# EAGLE design SNES_RGB_SV (EAGLE 9.6.2)
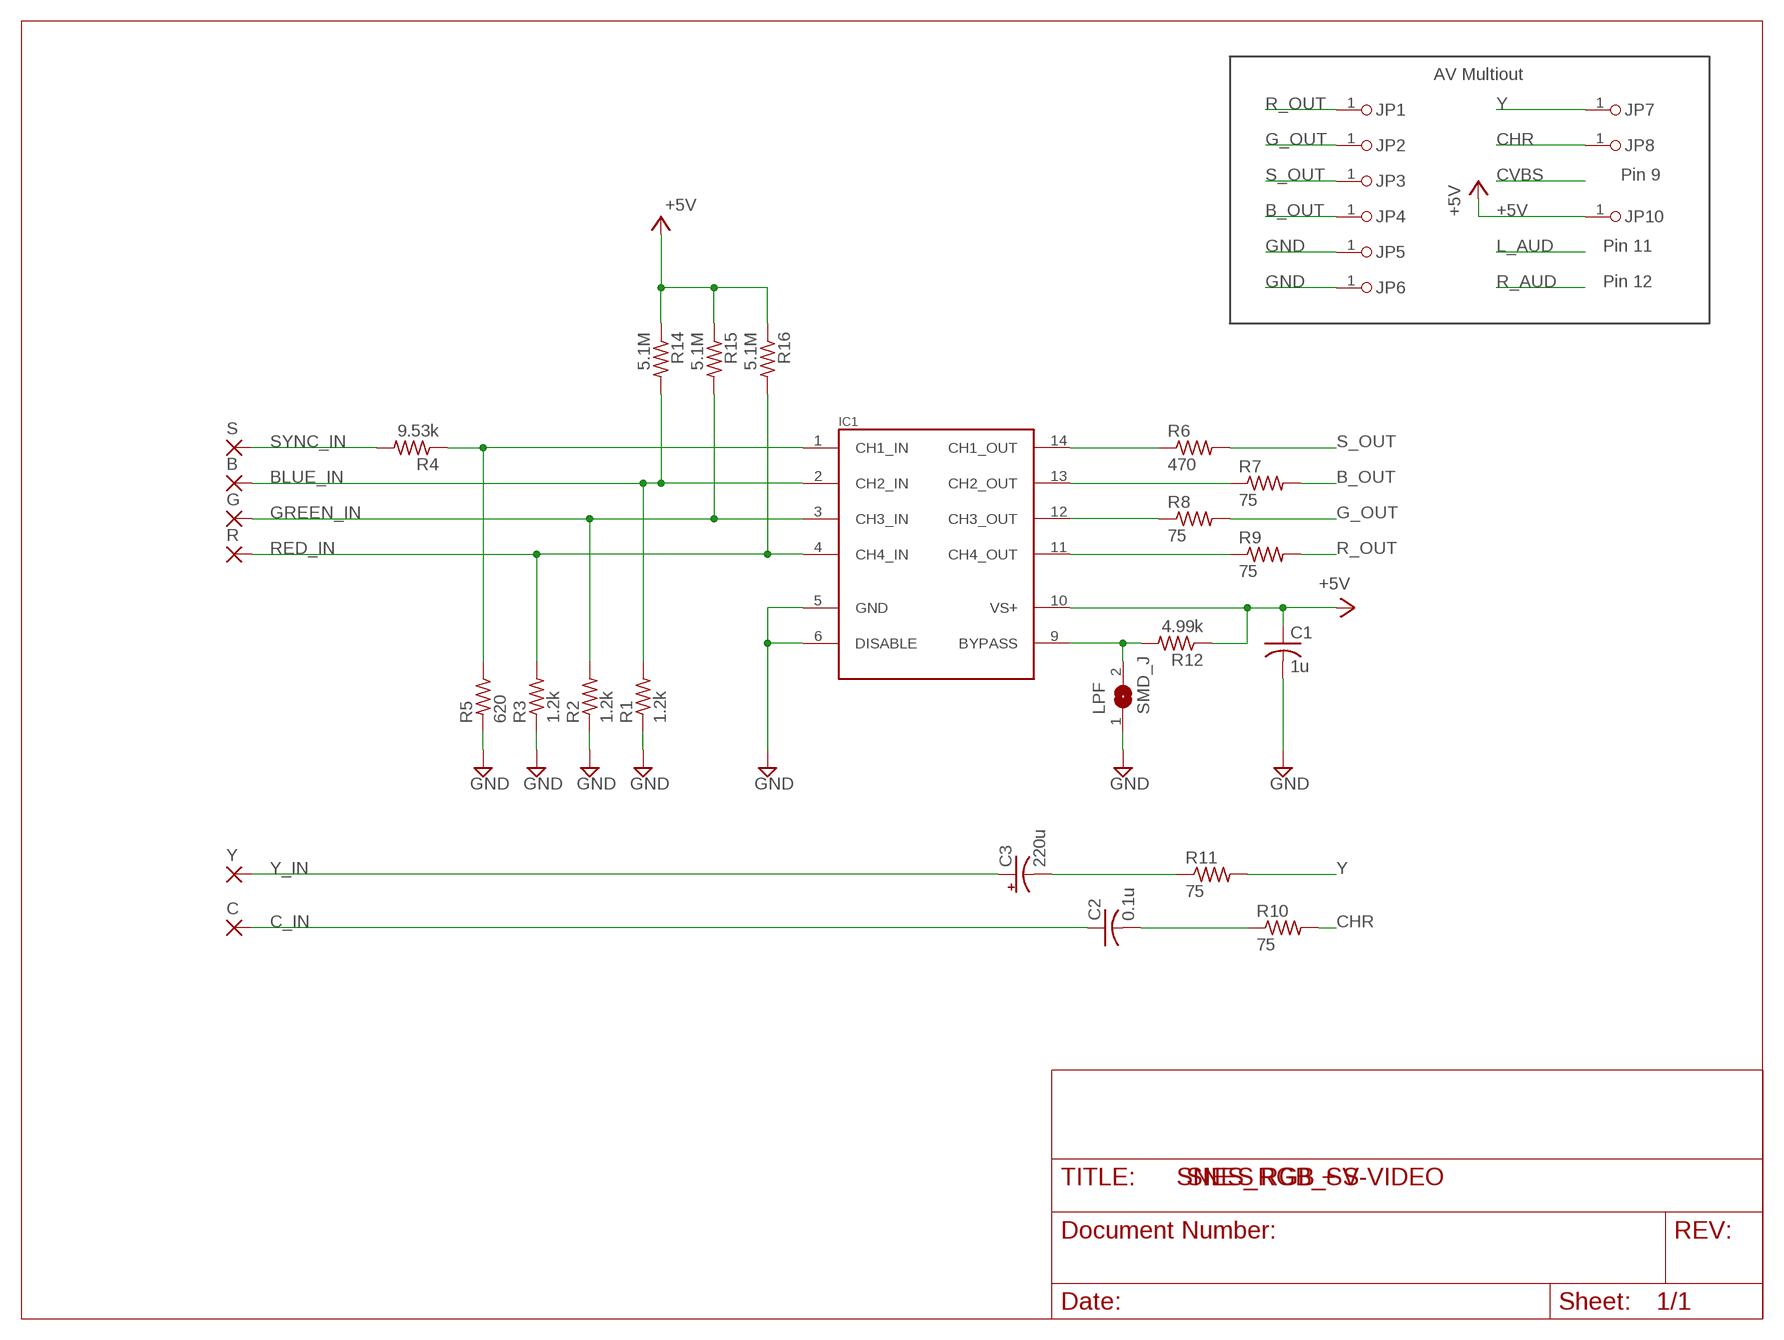
[diagram p0: schematic, sheet 1]

## Parts
B  SMD2  [SMD1,27-2,54]
C  SMD2  [SMD1,27-2,54]
C1  1u  C-USC0603  [C0603]
C2  0.1u  C-USC0603  [C0603]
C3  220u  CPOL-USC/6032-28R  [C/6032-28R]
G  SMD2  [SMD1,27-2,54]
IC1  THS7374IPWR  [TSSOP14]
JP1  PINHD-1X1  [1X01]
JP2  PINHD-1X1  [1X01]
JP3  PINHD-1X1  [1X01]
JP4  PINHD-1X1  [1X01]
JP5  PINHD-1X1  [1X01]
JP6  PINHD-1X1  [1X01]
JP7  PINHD-1X1  [1X01]
JP8  PINHD-1X1  [1X01]
JP10  PINHD-1X1  [1X01]
LPF  SMD_J  [SJ]
R  SMD2  [SMD1,27-2,54]
R1  1.2k  R-US_R0603  [R0603]
R2  1.2k  R-US_R0603  [R0603]
R3  1.2k  R-US_R0603  [R0603]
R4  9.53k  R-US_R0603  [R0603]
R5  620  R-US_R0603  [R0603]
R6  470  R-US_R0603  [R0603]
R7  75  R-US_R0603  [R0603]
R8  75  R-US_R0603  [R0603]
R9  75  R-US_R0603  [R0603]
R10  75  R-US_R0603  [R0603]
R11  75  R-US_R0603  [R0603]
R12  4.99k  R-US_R0603  [R0603]
R14  5.1M  R-US_R0603  [R0603]
R15  5.1M  R-US_R0603  [R0603]
R16  5.1M  R-US_R0603  [R0603]
S  SMD2  [SMD1,27-2,54]
Y  SMD2  [SMD1,27-2,54]

## Nets
+5V: C1.1 IC1.10(VS+) JP10.1 R12.1 R14.1 R15.1 R16.1
B_OUT: JP4.1 R7.2
BLUE_IN: B.1(P) IC1.2(CH2_IN) R1.2 R14.2
C_IN: C2.1 C.1(P)
CHR: JP8.1 R10.2
G_OUT: JP2.1 R8.2
GND: C1.2 IC1.5(GND) IC1.6(DISABLE) JP5.1 JP6.1 LPF.1 R1.1 R2.1 R3.1 R5.2
GREEN_IN: G.1(P) IC1.3(CH3_IN) R2.2 R15.2
N$1: IC1.1(CH1_IN) R4.1 R5.1
N$2: IC1.9(BYPASS) LPF.2 R12.2
N$3: IC1.14(CH1_OUT) R6.1
N$4: IC1.13(CH2_OUT) R7.1
N$5: IC1.12(CH3_OUT) R8.1
N$6: IC1.11(CH4_OUT) R9.1
N$7: C2.2 R10.1
N$10: C3.- R11.1
R_OUT: JP1.1 R9.2
RED_IN: IC1.4(CH4_IN) R3.2 R16.2 R.1(P)
S_OUT: JP3.1 R6.2
SYNC_IN: R4.2 S.1(P)
Y: JP7.1 R11.2
Y_IN: C3.+ Y.1(P)

## Notes on the sheet
- AV Multiout
- Pin 9
- Pin 11
- Pin 12
- SNES RGB + S-VIDEO

## Library data of the parts
B C G R S Y = wirepad:SMD2: SMD PAD
C1 C2 = My_Devices:C-US: CAPACITOR, American symbol
C3 = My_Devices:CPOL-US: POLARIZED CAPACITOR, American symbol; SPICEPREFIX: C
IC1 = My_Devices:THS7374
JP1-JP8 JP10 = My_Devices:PINHD-1X1: PIN HEADER
LPF = My_Devices:SMD_J
R1-R12 R14-R16 = My_Devices:R-US_: RESISTOR, American symbol

## Board
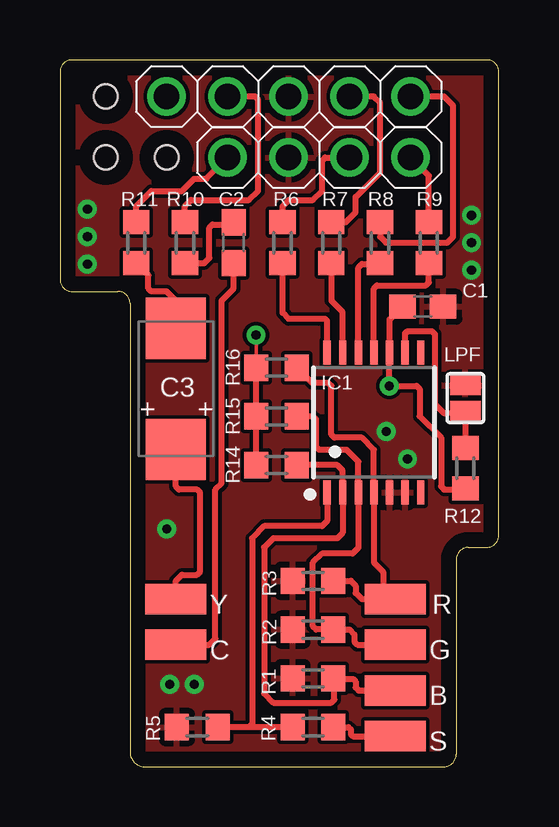
[diagram p1: board, top side]
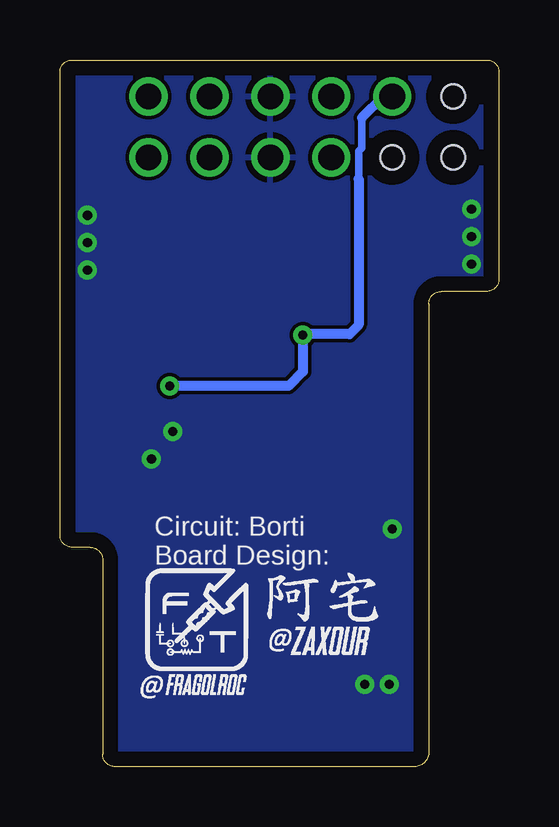
[diagram p2: board, bottom side, seen from below]

Size 18.29 x 29.48 mm. Coordinates in mm from the lower left corner, seen from the top.
Outline: 3.68,0.01 16,0.01 arc90 16.51,0.52 16.51,8.65 arc-90 17.02,9.16 17.78,9.16 arc90 18.29,9.66 18.29,28.97 arc90 17.78,29.48 0.51,29.48 arc90 0,28.97 0,20.33 arc90 0.51,19.82 2.41,19.82 arc-90 2.92,19.32 2.92,0.52 arc90 3.68,0.01
Copper layers (1*16): Top 0.035mm / dielectric 1.5mm / Bottom 0.035mm
Design rules "default *": minimum track width 6mil, minimum drill 0.35mm, track to track 6mil, track to pad 6mil, pad to pad 6mil, via to via 6mil, smd to smd 6mil, copper to edge 25mil, drill to drill 6mil, minimum pad ring 10mil, minimum via ring 8mil, stop-mask expansion 4mil, vias tented up to drill 16mil, thermal gap 10mil
Holes 0.99 mm at 1.91,27.95 1.91,25.41 4.45,25.41

### Footprints (pad centres in the part's own frame; a part is rotated, then mirrored left to right if it is on the bottom)
SMD1,27-2,54 = smd 1.27 x 2.54: 1 0,0
C0603 = smd 1.1 x 1: 1 -0.85,0; 2 0.85,0
C/6032-28R = smd 2.55 x 2.5: + 2.525,0; - -2.525,0
TSSOP14 = smd 0.305 x 0.991: 1 -1.95,-2.918; 2 -1.3,-2.918; 3 -0.65,-2.918; 4 0,-2.918; 5 0.65,-2.918; 6 1.3,-2.918; 7 1.95,-2.918; 8 1.95,2.918; 9 1.3,2.918; 10 0.65,2.918; 11 0,2.918; 12 -0.65,2.918; 13 -1.3,2.918; 14 -1.95,2.918
1X01 = drill 1.067 pad 1.575: 1 0,0
SJ = smd 0.813 x 1.27: 1 -0.533,0; 2 0.533,0
R0603 = smd 1 x 1.1: 1 -0.85,0; 2 0.85,0

### Placement (x,y rotation side)
B  13.97,3.19 270 top
C  4.83,5.09 270 top
C1  15.11,19.19 0 top
C2  7.24,21.86 90 top
C3  4.83,15.76 270 top
G  13.97,5.09 270 top
IC1  13.08,14.36 0 top
JP1  14.61,25.41 0 top
JP2  14.61,27.95 0 top
JP3  12.07,25.41 0 top
JP4  12.07,27.95 0 top
JP5  9.53,25.41 0 top
JP6  9.53,27.95 0 top
JP7  6.99,25.41 0 top
JP8  6.99,27.95 0 top
JP10  4.45,27.95 0 top
LPF  16.89,15.38 270 top
R  13.97,7 270 top
R1  10.54,3.7 0 top
R2  10.54,5.73 0 top
R3  10.54,7.76 0 top
R4  10.54,1.66 0 top
R5  5.71,1.66 180 top
R6  9.27,21.86 90 top
R7  11.3,21.86 90 top
R8  13.34,21.86 90 top
R9  15.37,21.86 90 top
R10  5.21,21.86 90 top
R11  3.18,21.86 90 top
R12  16.89,12.46 90 top
R14  9.02,12.59 0 top
R15  9.02,14.62 0 top
R16  9.02,16.65 0 top
S  13.97,1.28 270 top
Y  4.83,7 270 top

### Tracks (layer width: path | path; a pad name or v marks a point on that pad's centre or on a via)
+5V  (via drill 0.38)
  Top 0.152: v8.17,18.01 R16.1
  Top 0.254: C1.1 13.73,18.66 IC1.10 13.72,17.27 v13.72,15.89 14.86,15.89 14.99,15.76 14.99,14.62 15.88,13.73 15.88,11.7 16,11.57 16.85,11.57 R12.1 | R14.1 R15.1 R16.1
  Bottom 0.305: 5.84,24.52 5.84,25.67 5.71,25.79 5.71,27.06
  Bottom 0.406: JP10.1 4.83,27.95 5.71,27.06 | v13.72,15.89 8.76,15.89 8.17,16.48 v8.17,18.01 8.13,18.05 6.22,18.05 5.84,18.43 5.84,24.52
B_OUT
  Top 0.254: R7.2 11.9,22.71 12.32,23.13 12.32,23.76 13.34,24.78 13.34,27.7 13.08,27.95 JP4.1
BLUE_IN
  Top 0.254: R14.2 11.56,12.59 11.78,12.36 IC1.2 11.78,9.76 11.56,9.54 8.89,9.54 8.51,9.16 8.51,3.06 8.89,2.68 11.3,2.68 11.43,2.81 11.43,3.66 R1.2 11.42,3.67 12.22,3.67 12.32,3.57 12.32,3.31 12.45,3.19 B.1
C_IN
  Top 0.254: C.1 6.22,5.09 6.48,5.35 6.48,11.57 6.73,11.82 6.73,19.44 7.24,19.95 C2.1
CHR
  Top 0.254: R10.2 5.21,23.38 5.46,23.63 7.87,23.63 8.26,24.02 8.26,27.83 8.13,27.95 JP8.1
G_OUT
  Top 0.254: R8.2 13.34,22.11 13.59,21.86 16.13,21.86 16.38,22.11 16.38,27.57 16,27.95 JP2.1
GND  (via drill 0.38)
  other vias: 17.14,20.71 1.14,20.97 1.14,22.11 1.14,23.25 17.14,21.86 17.14,23 14.48,12.84 13.59,13.98 4.45,9.92 4.57,3.44 5.59,3.44
  pour Bottom: -0.63,30.49 -0.63,-3.8 23.5,-3.8 23.5,30.49
  pour Top: -1.27,-3.8 24.13,-3.8 24.13,30.49 -1.27,30.49
GREEN_IN
  Top 0.254: R15.2 10.54,14.62 10.67,14.49 10.67,13.35 10.79,13.22 11.94,13.22 12.43,12.73 IC1.3 12.43,9.14 12.19,8.9 10.92,8.9 10.54,8.52 10.54,5.85 10.67,5.73 R2.2 12.07,5.73 12.27,5.52 12.27,5.22 12.39,5.09 G.1
N$1
  Top 0.254: R4.1 7.87,1.66 | 7.87,1.66 R5.1 | IC1.1 11.13,10.25 10.92,10.05 8.51,10.05 8,9.54 8,1.79 7.87,1.66
N$2
  Top 0.254: IC1.9 14.38,18.08 14.48,18.17 15.49,18.17 15.62,18.05 15.62,15.13 16,14.74 LPF.2 R12.2
N$3
  Top 0.254: IC1.14 11.13,18.6 11.05,18.68 9.53,18.68 9.27,18.94 R6.1
N$4
  Top 0.254: R7.1 11.3,19.44 11.78,18.97 IC1.13
N$5
  Top 0.254: IC1.12 12.43,20.83 12.57,20.97 13.3,20.97 R8.1
N$6
  Top 0.254: IC1.11 13.08,19.95 13.21,20.08 15.24,20.08 15.37,20.21 R9.1
N$7
  Top 0.254: R10.1 6.01,21.01 6.22,21.22 6.22,22.49 6.35,22.62 7.15,22.62 C2.2
N$10
  Top 0.254: C3.- 4.83,19.44 4.45,19.82 3.81,19.82 3.68,19.95 3.68,20.5 R11.1
R_OUT
  Top 0.254: R9.2 15.37,24.65 JP1.1
RED_IN
  Top 0.254: R.1 13.72,7 13.46,7 | 13.46,7 13.46,8.14 13.08,8.52 IC1.4 13.08,13.22 12.57,13.73 11.43,13.73 11.3,13.86 11.3,15.89 11.18,16.01 10.5,16.01 R16.2 | R3.2 12.12,7.76 12.32,7.56 12.32,7.25 12.57,7 13.46,7
S_OUT
  Top 0.254: R6.2 9.27,23.38 9.53,23.63 10.54,23.63 10.92,24.02 10.92,25.29 11.05,25.41 JP3.1
SYNC_IN
  Top 0.254: R4.2 12.01,1.66 12.12,1.56 12.12,1.36 12.19,1.28 S.1
Y
  Top 0.254: R11.2 3.18,23.38 3.81,24.02 5.08,24.02 5.59,24.52 6.1,24.52 JP7.1
Y_IN
  Top 0.254: Y.1 4.83,7.76 5.08,8.01 5.71,8.01 5.84,8.14 5.84,11.44 5.71,11.57 4.95,11.57 4.83,11.7 C3.+

### Text on the board
tNames: + | +
bNames: Circuit: Borti / Board Design:
top_silk: +
200bmp: D:/SkyDrive/My Documents/EAGLE/projects/SNES_RGB/twitterF.bmp | D:/SkyDrive/My Documents/EAGLE/projects/SNES_RGB/zlogo.bmp